# Altium schematic sheet DAQ_Board.SchDoc
size A3; SheetNumber: 1; SheetTotal: 1
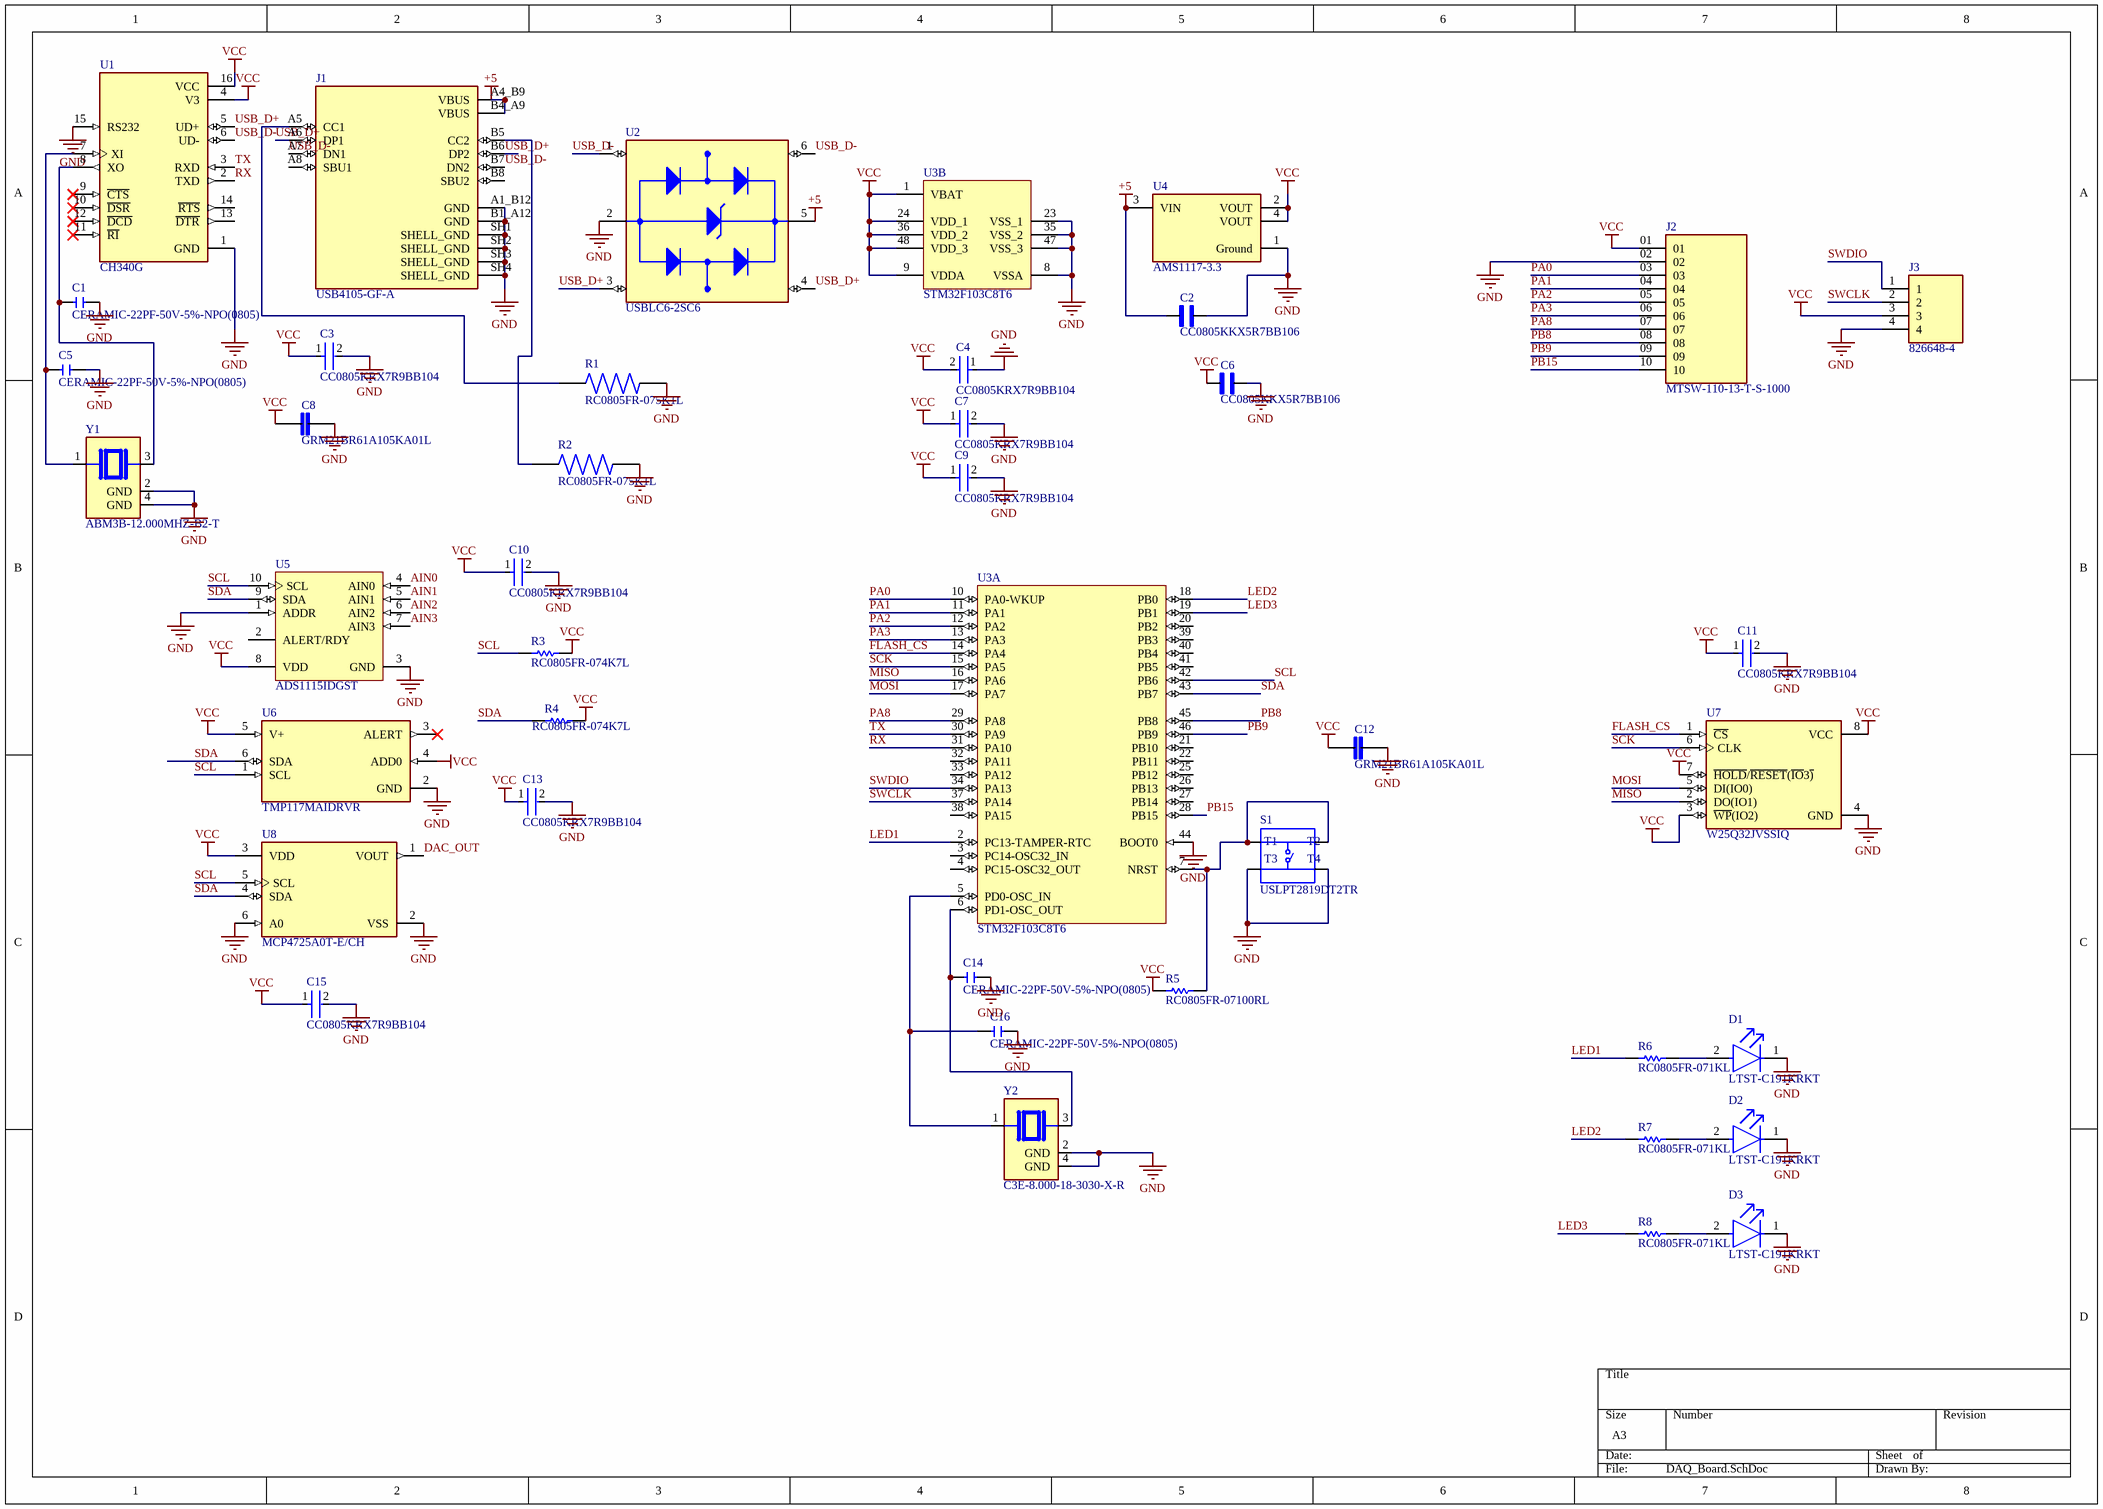
[diagram p0: DAQ_Board.SchDoc]

## Parts
C1  CERAMIC-22PF-50V-5%-NPO(0805)  [C0805]
C2  CC0805KKX5R7BB106  [CAPC2012X70]
C3  CC0805KRX7R9BB104  [FP-CC0805-0_85-MFG]
C4  CC0805KRX7R9BB104  [FP-CC0805-0_85-MFG]
C5  CERAMIC-22PF-50V-5%-NPO(0805)  [C0805]
C6  CC0805KKX5R7BB106  [CAPC2012X70]
C7  CC0805KRX7R9BB104  [FP-CC0805-0_85-MFG]
C8  GRM21BR61A105KA01L  [CAPC2012X135N]
C9  CC0805KRX7R9BB104  [FP-CC0805-0_85-MFG]
C10  CC0805KRX7R9BB104  [FP-CC0805-0_85-MFG]
C11  CC0805KRX7R9BB104  [FP-CC0805-0_85-MFG]
C12  GRM21BR61A105KA01L  [CAPC2012X135N]
C13  CC0805KRX7R9BB104  [FP-CC0805-0_85-MFG]
C14  CERAMIC-22PF-50V-5%-NPO(0805)  [C0805]
C15  CC0805KRX7R9BB104  [FP-CC0805-0_85-MFG]
C16  CERAMIC-22PF-50V-5%-NPO(0805)  [C0805]
D1  LTST-C191KRKT  [FP-LTST-C191KRKT-MFG]
D2  LTST-C191KRKT  [FP-LTST-C191KRKT-MFG]
D3  LTST-C191KRKT  [FP-LTST-C191KRKT-MFG]
J1  USB4105-GF-A  [GCT_USB4105-GF-A]
J2  MTSW-110-13-T-S-1000  [SAMTEC_MTSW-110-13-T-S-1000]
J3  826648-4  [TE_826648-4]
R1  RC0805FR-075K1L  [RESC2012X60N]
R2  RC0805FR-075K1L  [RESC2012X60N]
R3  RC0805FR-074K7L  [YAGO-RC0805_M]
R4  RC0805FR-074K7L  [YAGO-RC0805_M]
R5  RC0805FR-07100RL  [RESC2013X60X35ML10T20]
R6  RC0805FR-071KL  [RESC2013X60X35ML10T20]
R7  RC0805FR-071KL  [RESC2013X60X35ML10T20]
R8  RC0805FR-071KL  [RESC2013X60X35ML10T20]
S1  USLPT2819DT2TR  [SW_USLPT2819DT2TR]
U1  CH340G  [SOIC127P600X180-16N]
U2  USBLC6-2SC6  [SOT95P280X145-6N]
U3  STM32F103C8T6  [STM-LQFP48_L]  (parts A,B of 2)
U4  AMS1117-3.3  [FP-AMS1117-IPC_C]
U5  ADS1115IDGST  [TI-DGS10_M]
U6  TMP117MAIDRVR  [FP-DRV0006B-IPC_C]
U7  W25Q32JVSSIQ  [SOIC127P790X216-8N]
U8  MCP4725A0T-E/CH  [FP-C04-028-CHY-IPC_A]
Y1  ABM3B-12.000MHZ-B2-T  [XTAL_ABM3B-12.000MHZ-B2-T]
Y2  C3E-8.000-18-3030-X-R  [XTAL_C3E-8.000-18-3030-X-R]

## Nets
+5: C2.2 J1.A4_B9(VBUS) J1.B4_A9(VBUS) U2.5(VBUS) U4.3(VIN)
GND: C1.2 C2.1 C3.2 C4.1 C5.2 C6.1 C7.2 C8.2 C9.2 C10.2 C11.2 C12.2 C13.2 C14.2 C15.2 C16.2 D1.1(C) D2.1(C) D3.1(C) J1.A1_B12(GND) J1.B1_A12(GND) J1.SH1(SHELL_GND) J1.SH2(SHELL_GND) J1.SH3(SHELL_GND) J1.SH4(SHELL_GND) J2.02 J3.4 R1.2 R2.2 S1.3(T3) S1.4(T4) U1.1(GND) U1.15(RS232) U2.2(GND) U3.8(VSSA) U3.23(VSS_1) U3.35(VSS_2) U3.44(BOOT0) U3.47(VSS_3) U4.1(Ground) U5.1(ADDR) U5.3(GND) U6.2(GND) U7.4(GND) U8.2(VSS) U8.6(A0) Y1.2(GND) Y1.4(GND) Y2.2(GND) Y2.4(GND)
VCC: C3.1 C4.2 C6.2 C7.1 C8.1 C9.1 C10.1 C11.1 C12.1 C13.1 C15.1 J2.01 J3.3 R3.2 R4.2 R5.1 U1.4(V3) U1.16(VCC) U3.1(VBAT) U3.9(VDDA) U3.24(VDD_1) U3.36(VDD_2) U3.48(VDD_3) U4.2(VOUT) U4.4(VOUT) U5.8(VDD) U6.4(ADD0) U6.5(V+) U7.3(~{WP}(IO2)) U7.7(~{HOLD}/~{RESET}(~{IO}3~{)}) U7.8(VCC) U8.3(VDD)
AIN0: U5.4(AIN0)
AIN1: U5.5(AIN1)
AIN2: U5.6(AIN2)
AIN3: U5.7(AIN3)
DAC_OUT: U8.1(VOUT)
FLASH_CS: U3.14(PA4) U7.1(~{CS})
LED1: R6.1 U3.2(PC13-TAMPER-RTC)
LED2: R7.1 U3.18(PB0)
LED3: R8.1 U3.19(PB1)
MISO: U3.16(PA6) U7.2(DO(IO1))
MOSI: U3.17(PA7) U7.5(DI(IO0))
PA0: J2.03 U3.10(PA0-WKUP)
PA1: J2.04 U3.11(PA1)
PA2: J2.05 U3.12(PA2)
PA3: J2.06 U3.13(PA3)
PA8: J2.07 U3.29(PA8)
PB8: J2.08 U3.45(PB8)
PB9: J2.09 U3.46(PB9)
PB15: J2.10 U3.28(PB15)
RX: U1.2(TXD) U3.31(PA10)
SCK: U3.15(PA5) U7.6(CLK)
SCL: R3.1 U3.42(PB6) U5.10(SCL) U6.1(SCL) U8.5(SCL)
SDA: R4.1 U3.43(PB7) U5.9(SDA) U6.6(SDA) U8.4(SDA)
SWCLK: J3.2 U3.37(PA14)
SWDIO: J3.1 U3.34(PA13)
TX: U1.3(RXD) U3.30(PA9)
USB_D+: J1.A6(DP1) J1.B6(DP2) U1.5(UD+) U2.3(I/O2_IN) U2.4(I/O2_OUT)
USB_D-: J1.A7(DN1) J1.B7(DN2) U1.6(UD-) U2.1(I/O1_IN) U2.6(I/O1_OUT)
NetC1_1: C1.1 U1.8(XO) Y1.3
NetC5_1: C5.1 U1.7(XI) Y1.1
NetC14_1: C14.1 U3.6(PD1-OSC_OUT) Y2.3
NetC16_1: C16.1 U3.5(PD0-OSC_IN) Y2.1
NetD1_2: D1.2(A) R6.2
NetD2_2: D2.2(A) R7.2
NetD3_2: D3.2(A) R8.2
NetJ1_A5: J1.A5(CC1) R1.1
NetJ1_B5: J1.B5(CC2) R2.1
NetR5_2: R5.2 S1.1(T1) S1.2(T2) U3.7(NRST)

Not connected (* = marked no-connect by the designer): J1 A8(SBU1) B8(SBU2); U1 9(~{CTS})* 10(~{DSR})* 11(~{RI})* 12(~{DCD})* 13(~{DTR}) 14(~{RTS}); U3 3(PC14-OSC32_IN) 4(PC15-OSC32_OUT) 20(PB2) 21(PB10) 22(PB11) 25(PB12) 26(PB13) 27(PB14) 32(PA11) 33(PA12) 38(PA15) 39(PB3) 40(PB4) 41(PB5); U5 2(ALERT/RDY); U6 3(ALERT)*

## Library data of the parts
C1 C5 C14 C16 = CERAMIC-22PF-50V-5%-NPO(0805): 22 pF Â±5% 50V Ceramic Capacitor C0G, NP0 0805 (2012 Metric); MF: Yageo; MP: CC0805JRNPO9BN220; SnapEDA_Link: https://www.snapeda.com/parts/CC0805JRNPO9BN220/Yageo/view-part/?ref=snap; Package: 0805 Yageo; Value: *; Check_prices: https://www.snapeda.com/parts/CC0805JRNPO9BN220/Yageo/view-part/?ref=eda
C2 C6 = CC0805KKX5R7BB106: 10 ÂµF Â±10% 16V Ceramic Capacitor X5R 0805 (2012 Metric); MF: Yageo; SnapEDA_Link: https://www.snapeda.com/parts/CC0805KKX5R7BB106/Yageo/view-part/?ref=snap; Package: 0805 Yageo; Value: *; MP: CC0805KKX5R7BB106; Check_prices: https://www.snapeda.com/parts/CC0805KKX5R7BB106/Yageo/view-part/?ref=eda
C3 C4 C7 C9-C11 C13 C15 = CMP-2100-03606-3: CAP CER 0.1UF 50V X7R 0805; Manufacturer: Yageo; Tolerance: 0.1; Capacitance: 100 nF; Value: 100 nF; Material: Ceramic; Device Class L1: Passive Components; ComponentLink2Description: Datasheet; Package: CC0805-0.85; Manufacturer Part Number: CC0805KRX7R9BB104; Digikey Description: CAP CER 0.1UF 50V X7R 0805; Device Class L3: Ceramic Capacitors; Temperature: -30°C to +85°C; Temperature Characteristic: X7R; Voltage Rating: 50 V; Height: 0.95mm; RoHS: TRUE; Ipc Land Pattern Name: CAPC200125X85; Device Class L2: Capacitors; Category: Cap; Temperature Range Low: -30°C; Temperature Range High: +85°C; Mouser Description: Multilayer Ceramic Capacitors MLCC - SMD/SMT 100nF 50V X7R 10%; Footprint Url: http://www.yageo.com/exep/pages/download/literatures/UPY-C_GEN_24.pdf; Automotive: No; Octopart: https://octopart.com/cc0805krx7r9bb104-yageo-192993; Lead Free: Yes; ComponentLink2URL: http://www.yageo.com/documents/recent/UPY-GPHC_Y5V_6.3V-to-50V_8.pdf
C8 C12 = GRM21BR61A105KA01L: SMD Capacitor X5R(EIA) with Capacitance: 1.0uF Tol. 10%. Rated Voltage: 10Vdc; MF: Murata; SnapEDA_Link: https://www.snapeda.com/parts/GRM21BR61A105KA01L/Murata/view-part/?ref=snap; Package: 805-2 Murata; Value: *; MP: GRM21BR61A105KA01L; Check_prices: https://www.snapeda.com/parts/GRM21BR61A105KA01L/Murata/view-part/?ref=eda
D1-D3 = CMP-2000-05199-2: NexarPartId: 549908; Illumination Color: Red; Lens Transparency: Clear; Luminous Intensity: 54mcd; Current: 2A; Forward Current: 20mA; Number of Elements: 1; Power Rating: 75mW; Lens Color: Colorless; Wavelength: 639nm; Viewing Angle: 130°; Voltage: 2V; Dominant Wavelength: 631nm; Reverse Voltage: 5V; Height: 550µm; Length: 1.6mm; Number of Pins: 2; Packaging: Tape and Reel; Mount: Surface Mount; Case Code (Metric): 1608; Radiation Hardening: No; Case Code (Imperial): 0603; Test Current: 20mA; Number of LEDs: 1; Schedule B: 8541402000, 8541402000; Lead Free: Lead Free; Power Dissipation: 75mW; RoHS: Compliant; Forward Voltage: 2V; Lens Style: Clear; Color: Red; Max Operating Temperature: 85°C; Depth: 800µm; Width: 800µm; Min Operating Temperature: -55°C; Case/Package: 0603
J1 = USB4105-GF-A: MF: {'manufacturer': u'GCT'}; Package: None; Price: None; Value: *; MP: USB4105-GF-A; Availability: Unavailable
J3 = 826648-4: Connector Header Through Hole 4 position 0.100 (2.54mm); MF: TE Connectivity; Package: None; Value: *; Availability: Warning; EU_RoHS_Compliance: Compliant; MP: 826648-4; Check_prices: https://www.snapeda.com/parts/826648-4/TE%20Connectivity%20AMP%20Connectors/view-part/2390536/?ref=eda; SnapEDA_Link: https://www.snapeda.com/parts/826648-4/TE%20Connectivity%20AMP%20Connectors/view-part/2390536/?ref=snap; Price: None
R1 R2 = RC0805FR-075K1L: MF: {'manufacturer': u'YAGEO'}; Package: None; Price: None; Value: *; MP: RC0805FR-075K1L; Availability: Unavailable
R3 R4 = CMP-1568-00001-1: General Puprose Chip Resistor, 4700 Ohm +/- 1%, 0.125 W, -55 to 155 degC, 2-Pin SMD, RoHS, Tape and Reel; Tolerance: +/- 1%; Power: 0.125 W; PackageDescription: 2-Pin Surface Mount Device, Body 2 x 1.25 mm; ComponentLink2URL: http://www.yageo.com/documents/recent/PYu-RC_Group_51_RoHS_L-3.pdf; Temperature Min: -55 degC; Packing: Tape and Reel; Mounting Technology: Surface Mount; PartNumber: RC0805FR-074K7L; ComponentLink1URL: http://www.yageo.com/NewPortal/_en/index.jsp; Resistance: 4700 Ohm; Temperature Max: 155 degC; ComponentLink2Description: Datasheet; DatasheetVersion: Rev. 3; RoHS: TRUE; ComponentLink1Description: Manufacturer URL
R5 = CMP-2100-03669-1: Chip Resistor, 100 Ohm, +/-1%, 0.125 W, -55 to 155 degC, 0805 (2012 Metric), RoHS, Tape and Reel; Manufacturer: Yageo; Power Rating: 125mW; Resistance: 100Ohm; Voltage Rating: 150V; Tolerance: 1%; Temperature Coefficient: 100ppm/degreesC; Length: 2mm; Package Description: 2-Pin Surface Mounted Device, Body 2 x 1.25 mm; Case Code (Imperial): 0805; Number of Pins: 2; Termination: SMD/SMT; Lead Pitch: 0.4mm; Package Quantity: 1; Height: 0.024inch; Case Code (Metric): 2012; Number of Terminations: 2; Datasheet Version: Rev. 5, 10/2016; Lead Free: LeadFree; Package Reference: 0805; Composition: ThickFilm; REACH SVHC: Unknown; Voltage Rating (DC): 150V; Min Operating Temperature: -55degC; Packaging: TapeandReel; Military Standard: Not; Case/Package: 0805; Datasheet URL: http://www.yageo.com/NewPortal/yageodocoutput?fileName=/pdf/R-Chip/PYu-RC_Group_51_RoHS_L_5.pdf; Max Operating Temperature: 155degC; Manufacturer URL: http://www.yageo.com/; Max Power Dissipation: 125mW; Width: 0.049inch; Depth: 1.25mm; RoHSCompliant: true
R6-R8 = CMP-2100-03671-1: Chip Resistor, 1 KOhm, +/- 1%, 125 mW, -55 to 155 degC, 0805 (2012 Metric), RoHS, Tape and Reel; Manufacturer: Yageo; Temperature Coefficient: 100ppm/degreesC; Voltage Rating (DC): 150V; Max Power Dissipation: 125mW; Resistance: 1KOhm; Number of Pins: 2; Number of Terminations: 2; Datasheet URL: http://www.yageo.com/NewPortal/yageodocoutput?fileName=/pdf/R-Chip/PYu-RC_Group_51_RoHS_L_5.pdf; Length: 0.079inch; Package Description: 2-Pin Surface Mounted Device, Body 2 x 1.25 mm; Depth: 1.25mm; Height: 0.024inch; Military Standard: Not; Case/Package: 0805; Package Reference: 0805; RoHSCompliant: true; Lead Free: LeadFree; Packaging: TapeandReel; Package Quantity: 1; Datasheet Version: Rev. 5, 10/2016; Tolerance: 1%; Min Operating Temperature: -55degC; Voltage Rating: 150V; Composition: ThickFilm; Case Code (Imperial): 0805; Power Rating: 125mW; Width: 0.049inch; Case Code (Metric): 2012; Manufacturer URL: http://www.yageo.com/; Max Operating Temperature: 155degC; REACH SVHC: Unknown; Termination: SMD/SMT
S1 = USLPT2819DT2TR: TACT ULTRA TB 2.8X1.9X0.6 160GF; Package: None; MP: USLPT2819DT2TR; Value: *; Availability: Unavailable; Price: None
U1 = CH340G: USB Interface Integrated Circuit; MF: WCH; Value: *; SnapEDA_Link: https://www.snapeda.com/parts/Ch340G/WCH/view-part/?ref=snap; MP: Ch340G; Check_prices: https://www.snapeda.com/parts/Ch340G/WCH/view-part/?ref=eda; Availability: Not in stock; Price: None; Package: None
U2 = USBLC6-2SC6: 17V Clamp 5A (8/20Âµs) Ipp Tvs Diode Surface Mount SOT-23-6; MF: STMicroelectronics; Value: *; SnapEDA_Link: https://www.snapeda.com/parts/USBLC6-2SC6/STMicroelectronics/view-part/?ref=snap; Check_prices: https://www.snapeda.com/parts/USBLC6-2SC6/STMicroelectronics/view-part/?ref=eda; Purchase-URL: https://pricing.snapeda.com/search/part/USBLC6-2SC6/?ref=eda; Price: None; Availability: In Stock; Package: SOT-23-6 STMicroelectronics; MP: USBLC6-2SC6
U3 = CMP-0237-00215-3: ARM Cortex-M3 32-bit MCU, 64 KB Flash, 20 KB Internal RAM, 37 I/Os, 48-pin LQFP, -40 to 85 degC, Tray; Supply Voltage(Vcc) min (V): 2; Internal RAM Size (kB): 20; FLASH Size (Prog) (kB): 64; A/D Converter: 2x12-bit (10 Channel); I/Os (High Current): 37; Operating Frequency(F) (Processor speed) (MHz): 72; Core: ARM Cortex-M3; ComponentLink3Description: Package Specification; Mounting Technology: Surface Mount; PartNumber: STM32F103C8T6; PackageReference: LQFP48; Packing: Tray; ComponentLink3URL: http://www.st.com/st-web-ui/static/active/en/resource/technical/document/datasheet/DM00058181.pdf; DatasheetVersion: Rev. 16; ComponentLink1URL: http://www.st.com/web/en/home.html; PackageVersion: Rev. 6, 06/2013; ComponentLink2URL: http://www.st.com/st-web-ui/static/active/en/resource/technical/document/datasheet/CD00161566.pdf; ComponentLink1Description: Manufacturer URL; ComponentLink2Description: Datasheet; PackageDescription: 48-Pin Low Profile Quad Flat Package, 7 x 7 mm Body, 0.5 mm Pitch
U4 = CMP-209535-000001-1: LDO Voltage Regulators 1A, 3.3V; Manufacturer: Advanced Monolithic Systems; Dropout Voltage: 1.1V; Output Type: Fixed; Nominal Supply Current: 5mA; Max Power Dissipation: 1.2W; Max Supply Voltage: 15V; Number Of Outputs: 1; Standoff Height: 0.64mm; Max Junction Temp: +125°C; Height: 1.8mm; Package: AMS1117; Device Class L2: Power Management ICs; ComponentLink2Description: Datasheet; ComponentLink2URL: http://www.advanced-monolithic.com/pdf/ds1117.pdf; Category: IC; RoHS: TRUE; Automotive: No; Device Class L1: Integrated Circuits (ICs); Output Current: 1A; Device Class L3: Voltage Regulators - Linear; Temperature: -40°C to +125°C; Output Voltage: 3.3V; Manufacturer Part Number: AMS1117-3.3; Temperature Range Low: -40°C; Octopart: https://octopart.com/ams1117-3.3-advanced+monolithic+systems-25899300; Lead Free: Yes; Ipc Land Pattern Name: SOT229P700X180-4; Temperature Range High: +125°C
U5 = CMP-0003-00378-2: 16-Bit ADC with Integrated Multiplexer, PGA, Comparator, Oscillator, and Reference, -40 to 125 degC, 10-pin SOP (DGS10), Green (RoHS & no Sb/Br); Manufacturer: Texas Instruments; Sample Rate (max)(SPS): 860; SubFamily: Precision ADC (<=10MSPS); Architecture: Delta-Sigma; Digital Supply(Min)(V): 2; Resolution(Bits): 16; Digital Supply(Max)(V): 5.5; INL(Max)(+/-LSB): 1; Interface: Serial I2C; # Input Channels: 4; Eco-Plan: Green (RoHS & no Sb/Br); PackageDescription: 10-Pin Plastic Small Outline, Body 3 x 3 mm, Pitch 0.5 mm; Mounting Technology: Surface Mount; PackageReference: DGS10; DatasheetVersion: SBAS444B; ComponentLink3Description: Package Specification; ComponentLink1Description: Manufacturer URL; PartNumber: ADS1115IDGST; ComponentLink3URL: http://www.ti.com/lit/ml/mpds035b/mpds035b.pdf; ComponentLink2URL: http://www.ti.com/general/docs/lit/getliterature.tsp?genericPartNumber=ADS1115&fileType=pdf; Analog Voltage AV/DD(Min)(V): 2; ComponentLink2Description: Datasheet; PackageVersion: 4073272/C, 02/2004; Analog Voltage AV/DD(Max)(V): 5.5; Code_JEDEC: MO-153; ComponentLink1URL: http://www.ti.com/
U6 = CMP-04948-000036-1: TEMPERATURE SENSOR; Resolution: 16b; Output Type: I2C; Packaging: Cut Tape; Mount: Surface Mount; Min Operating Temperature: -55°C; Max Operating Temperature: 150°C; RoHS Compliant: Yes
U7 = W25Q32JVSSIQ: FLASH - NOR Memory IC 32Mb (4M x 8) SPI - Quad I/O 133 MHz 8-SOIC; MF: Winbond; SnapEDA_Link: https://www.snapeda.com/parts/W25Q32JVSSIQ/Winbond+Electronics/view-part/?ref=snap; Package: SOIC-8 Winbond; Value: *; MP: W25Q32JVSSIQ; Check_prices: https://www.snapeda.com/parts/W25Q32JVSSIQ/Winbond+Electronics/view-part/?ref=eda
U8 = CMP-0188-00760-3: IC DAC 12BIT V-OUT SOT23-6; Number of Outputs: 1; Supply Type: Single; Integral Nonlinearity (INL): 14.5LSB; Polarity: Unipolar; Number of Bits: 12; Min Supply Voltage: 2.7V; Output Type: Voltage; Settling Time: 6us; Max Supply Voltage: 5.5V; Nominal Supply Current: 210uA; Resolution: 12b; Interface: I2C; Input Offset Voltage (Vos): 1.1mV; Radiation Hardening: No; Number of DAC Channels: 1; Length: 3.1mm; Number of D/A Converters: 1; Number of Pins: 6; Case/Package: SOT-23-6; Lead Free: Lead Free; Number of Channels: 1; Termination: SMD/SMT; Width: 1.8mm; Contact Plating: Tin; Package Quantity: 3000; Max Operating Temperature: 125°C; Min Operating Temperature: -40°C; REACH SVHC: No SVHC; Mount: Surface Mount; Height: 1.3mm; Packaging: Tape and Reel; Number of Converters: 1
Y1 = ABM3B-12.000MHZ-B2-T: 12 MHz Â±20ppm Crystal 18pF 70 Ohms 4-SMD, No Lead; MF: Abracon; SnapEDA_Link: https://www.snapeda.com/parts/ABM3B-12.000MHZ-B2-T/Abracon/view-part/?ref=snap; Package: SMD-4 Abracon LLC; Value: *; MP: ABM3B-12.000MHZ-B2-T; Check_prices: https://www.snapeda.com/parts/ABM3B-12.000MHZ-B2-T/Abracon/view-part/?ref=eda
Y2 = C3E-8.000-18-3030-X-R: Crystal, 3.20mm x2.50mm,8MHz,18pF,-40-85C; MF: Aker Technology USA; SnapEDA_Link: https://www.snapeda.com/parts/C3E-8.000-18-3030-X-R/Aker/view-part/?ref=snap; Package: SMD-4 Aker; Value: *; MP: C3E-8.000-18-3030-X-R; Check_prices: https://www.snapeda.com/parts/C3E-8.000-18-3030-X-R/Aker/view-part/?ref=eda
J2 = MTSW-110-13-T-S-1000: Price: None; Value: *; MP: MTSW-110-13-T-S-1000; Package: None; Availability: Unavailable